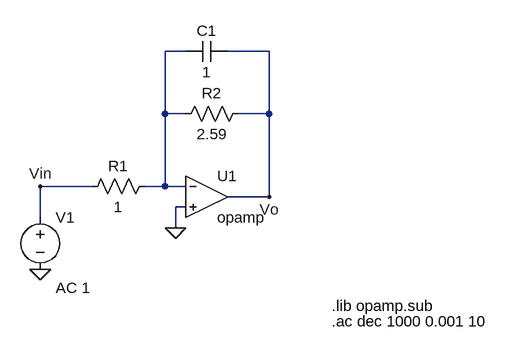
[diagram p0: schematic circuito simulación T desnormalizado.asc]
circuito simulación T desnormalizado.asc, the LTspice schematic file:
Version 4
SHEET 1 880 680
WIRE 0 -80 -32 -80
WIRE 128 -80 64 -80
WIRE -32 16 -32 -80
WIRE 0 16 -32 16
WIRE 128 16 128 -80
WIRE 128 16 80 16
WIRE -144 128 -224 128
WIRE -32 128 -32 16
WIRE -32 128 -64 128
WIRE 0 128 -32 128
WIRE 128 144 128 16
WIRE 128 144 64 144
WIRE 0 160 -16 160
WIRE -224 176 -224 128
WIRE -16 192 -16 160
FLAG -224 128 Vin
FLAG -224 256 0
FLAG -16 192 0
FLAG 128 144 Vo
SYMBOL res -48 112 R90
WINDOW 0 0 56 VBottom 2
WINDOW 3 32 56 VTop 2
SYMATTR InstName R1
SYMATTR Value 1
SYMBOL voltage -224 160 R0
WINDOW 123 24 124 Left 2
WINDOW 39 0 0 Left 0
SYMATTR Value2 AC 1
SYMATTR InstName V1
SYMATTR Value ""
SYMBOL OpAmps\\opamp 32 80 R0
SYMATTR InstName U1
SYMBOL res 96 0 R90
WINDOW 0 0 56 VBottom 2
WINDOW 3 32 56 VTop 2
SYMATTR InstName R2
SYMATTR Value 2.59
SYMBOL cap 64 -96 R90
WINDOW 0 0 32 VBottom 2
WINDOW 3 32 32 VTop 2
SYMATTR InstName C1
SYMATTR Value 1
TEXT 224 312 Left 2 !.lib opamp.sub
TEXT 224 336 Left 2 !.ac dec 1000 0.001 10

The netlist it stands for:
* circuito simulación T desnormalizado.asc
R1 N001 Vin 1
V1 Vin 0 AC 1
XU1 N001 0 Vo opamp Aol=100K GBW=10Meg  ; pins invin noninvin out
R2 Vo N001 2.59
C1 Vo N001 1
.lib opamp.sub
.ac dec 1000 0.001 10
.backanno
.end